# Altium schematic sheet CarteTxCapteurDistance 2.SchDoc
size A3; PageSetup: Record=PageOptions|CenterHorizontal=True|CenterVertical=True|PrintScale=1.04|XCorrection=1.00|YCorrection=1.00|PrintKind=0|BorderSize=5000000|LeftOffset=0|BottomOffset=0|Orientation=2|PaperLength=1000|PaperWidth=1000|Scale=100|PaperSource=7|PrintQuality=-4|MediaType=1|DitherType=10|PaperKind=A3|PrintScaleMode=1
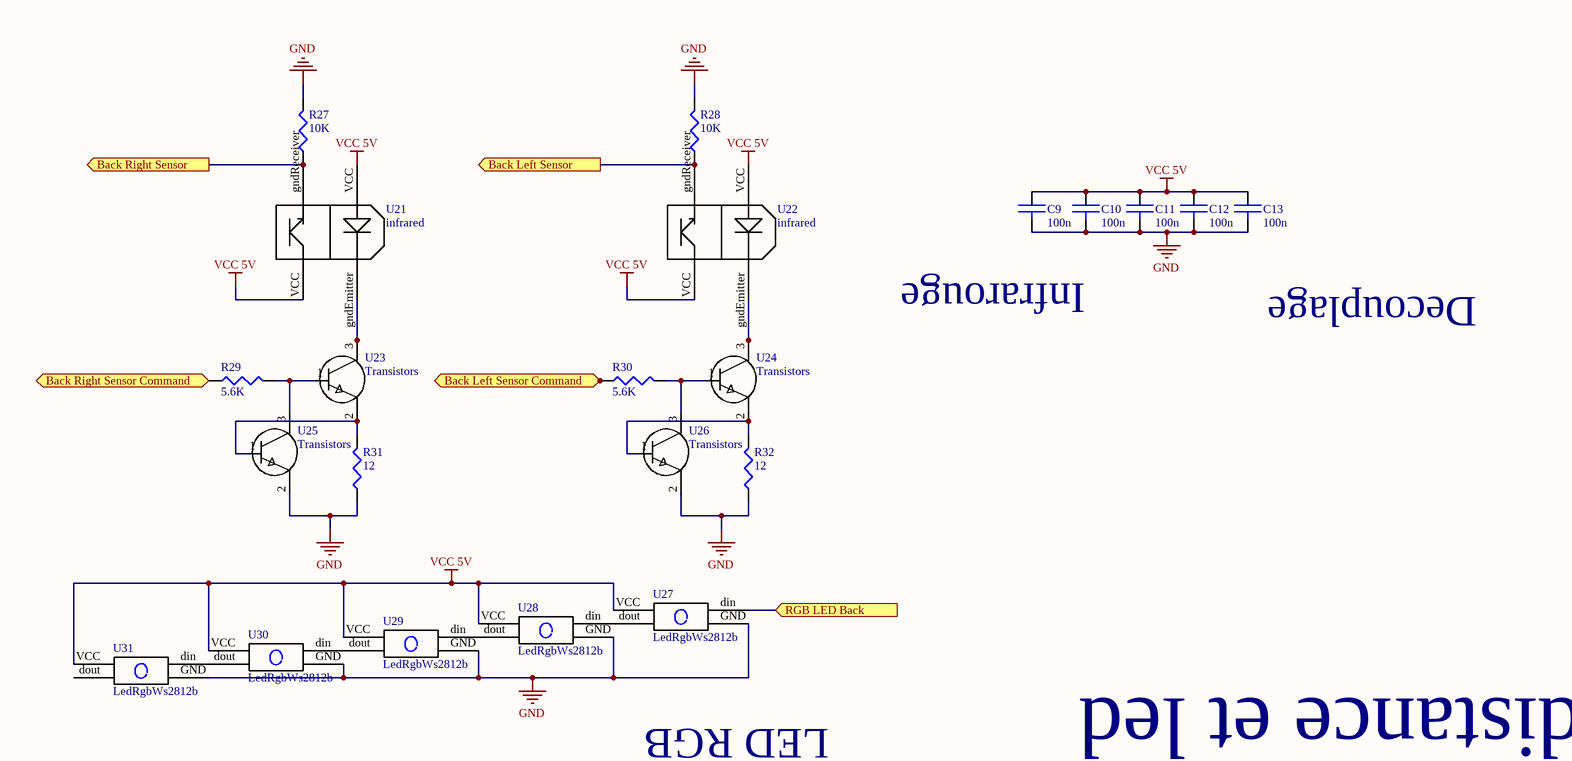
[diagram p0: CarteTxCapteurDistance 2.SchDoc, left]
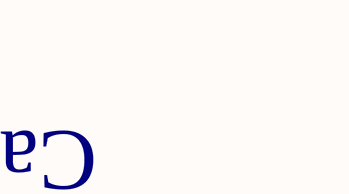
[diagram p1: CarteTxCapteurDistance 2.SchDoc, right]

## Parts
C9  value 100n  [0805]  (hidden comment: CAP)
C10  value 100n  [0805]  (hidden comment: CAP)
C11  value 100n  [0805]  (hidden comment: CAP)
C12  value 100n  [0805]  (hidden comment: CAP)
C13  value 100n  [0805]  (hidden comment: CAP)
R27  value 10K  [0805]  (hidden comment: RES)
R28  value 10K  [0805]  (hidden comment: RES)
R29  value 5.6K  [0805]  (hidden comment: RES)
R30  value 5.6K  [0805]  (hidden comment: RES)
R31  value 12  [0805]  (hidden comment: RES)
R32  value 12  [0805]  (hidden comment: RES)
U21  infrared  [Infrared]
U22  infrared  [Infrared]
U23  Transistors  [BC817-40]
U24  Transistors  [BC817-40]
U25  Transistors  [BC817-40]
U26  Transistors  [BC817-40]
U27  LedRgbWs2812b  [LedRgbWs2812b]
U28  LedRgbWs2812b  [LedRgbWs2812b]
U29  LedRgbWs2812b  [LedRgbWs2812b]
U30  LedRgbWs2812b  [LedRgbWs2812b]
U31  LedRgbWs2812b  [LedRgbWs2812b]

## Ports
Back Left Sensor (out), Back Left Sensor Command (in), Back Right Sensor (out), Back Right Sensor Command (in), RGB LED Back (in)

## Nets
GND: C9.2 C10.2 C11.2 C12.2 C13.2 R27.2 R28.2 R31.1 R32.1 U25.2(Emi) U26.2(Emi) U27.GND U28.GND U29.GND U30.GND U31.GND
VCC 5V: C9.1 C10.1 C11.1 C12.1 C13.1 U21.VCC U22.VCC U27.VCC U28.VCC U29.VCC U30.VCC U31.VCC
Back Left Sensor: R28.1 U22.gndReceiver ; port Back Left Sensor
Back Left Sensor Command: R30.1 ; port Back Left Sensor Command
Back Right Sensor: R27.1 U21.gndReceiver ; port Back Right Sensor
Back Right Sensor Command: R29.1 ; port Back Right Sensor Command
RGB LED Back: U27.din ; port RGB LED Back
NetR29_2: R29.2 U23.1(Base) U25.3(Co)
NetR30_2: R30.2 U24.1(Base) U26.3(Co)
NetR31_2: R31.2 U23.2(Emi) U25.1(Base)
NetR32_2: R32.2 U24.2(Emi) U26.1(Base)
NetU21_gndEmitter: U21.gndEmitter U23.3(Co)
NetU22_gndEmitter: U22.gndEmitter U24.3(Co)
NetU27_dout: U27.dout U28.din
NetU28_dout: U28.dout U29.din
NetU29_dout: U29.dout U30.din
NetU30_dout: U30.dout U31.din

Not connected (* = marked no-connect by the designer): U31 dout

## Notes on the sheet
- Infrarouge
- Decouplage
- LED RGB
- Capteur distance et led

## Library data of the parts
C9-C13 = CAP: capacité non polarisée
R27-R32 = RES: resistance
U21 U22 = RPR-359F
U23-U26 = Transistors: NPN transistor